# Altium schematic sheet 智能马桶综合检测台V2.0.SchDoc
size A1; PageSetup: Record=PageOptions|CenterHorizontal=True|CenterVertical=True|PrintScale=0.52|XCorrection=1.00|YCorrection=1.00|PrintKind=1|BorderSize=5000000|LeftOffset=0|BottomOffset=0|Orientation=2|PaperLength=2970|PaperWidth=2100|Scale=100|PaperSource=7|PrintQuality=600|MediaType=1|DitherType=10|PaperKind=A4|PrintScaleMode=1
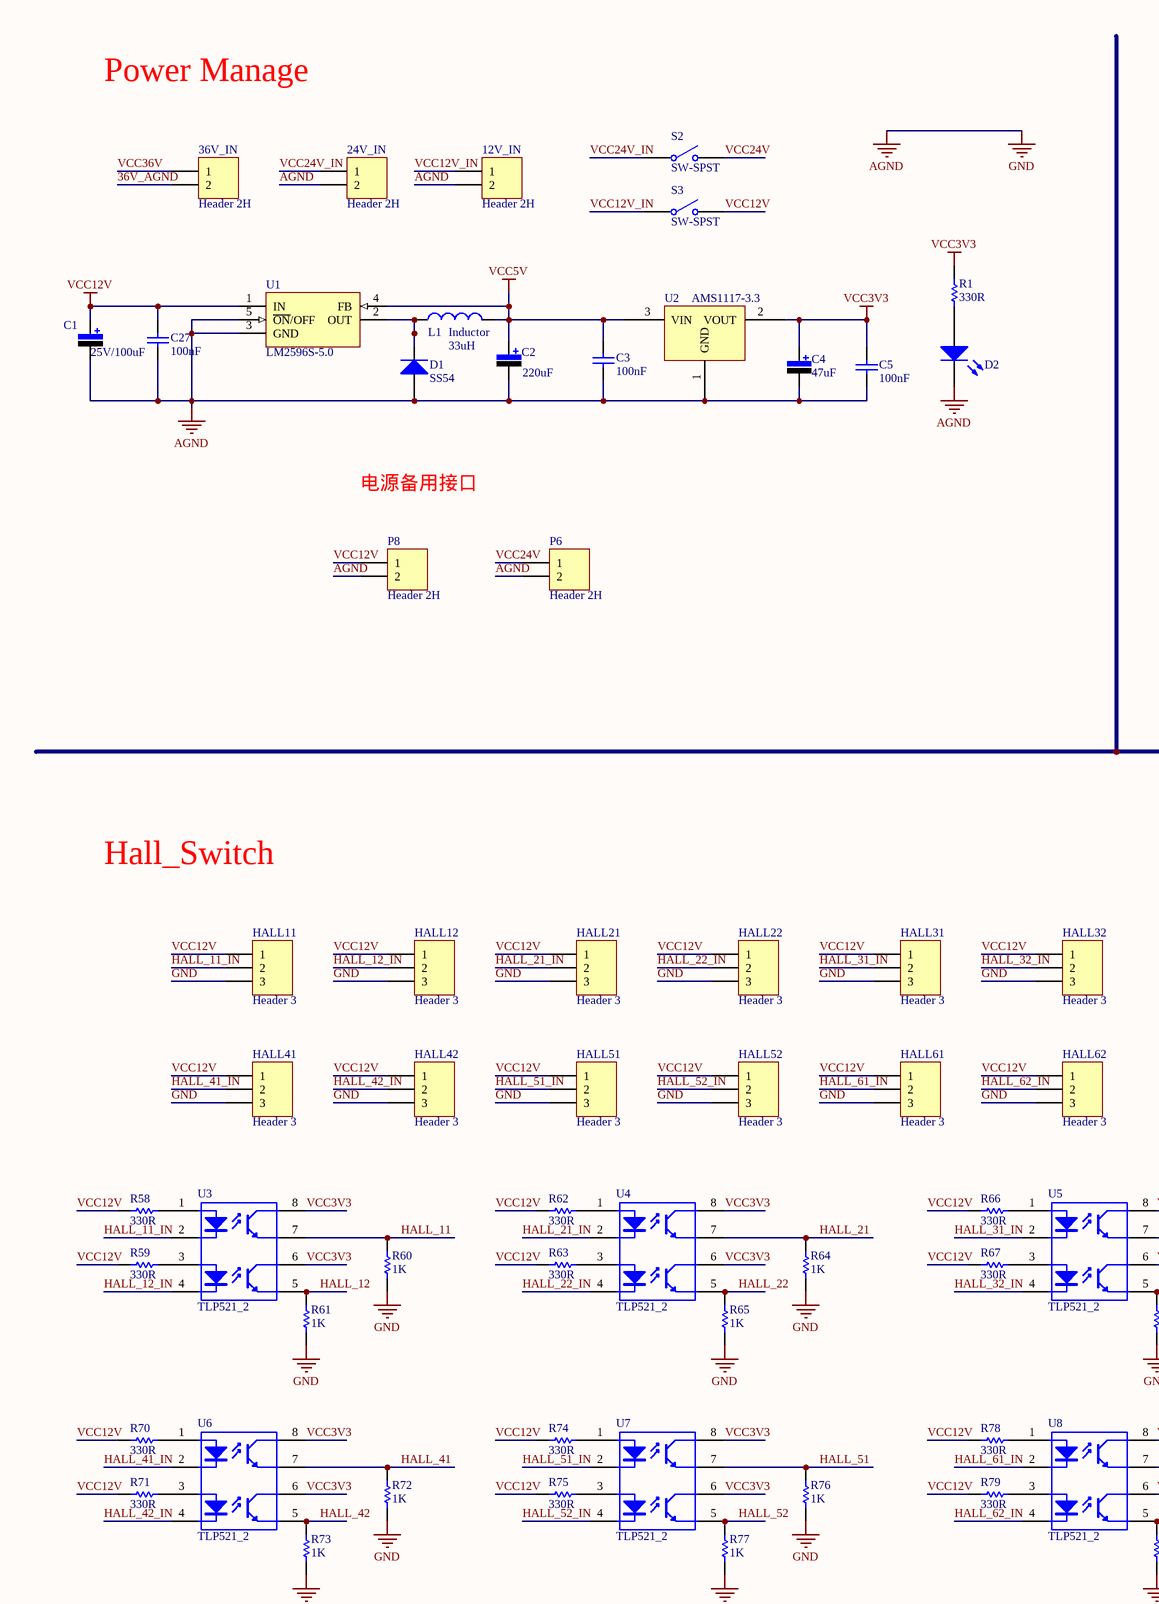
[diagram p0: 智能马桶综合检测台V2.0.SchDoc, top left]
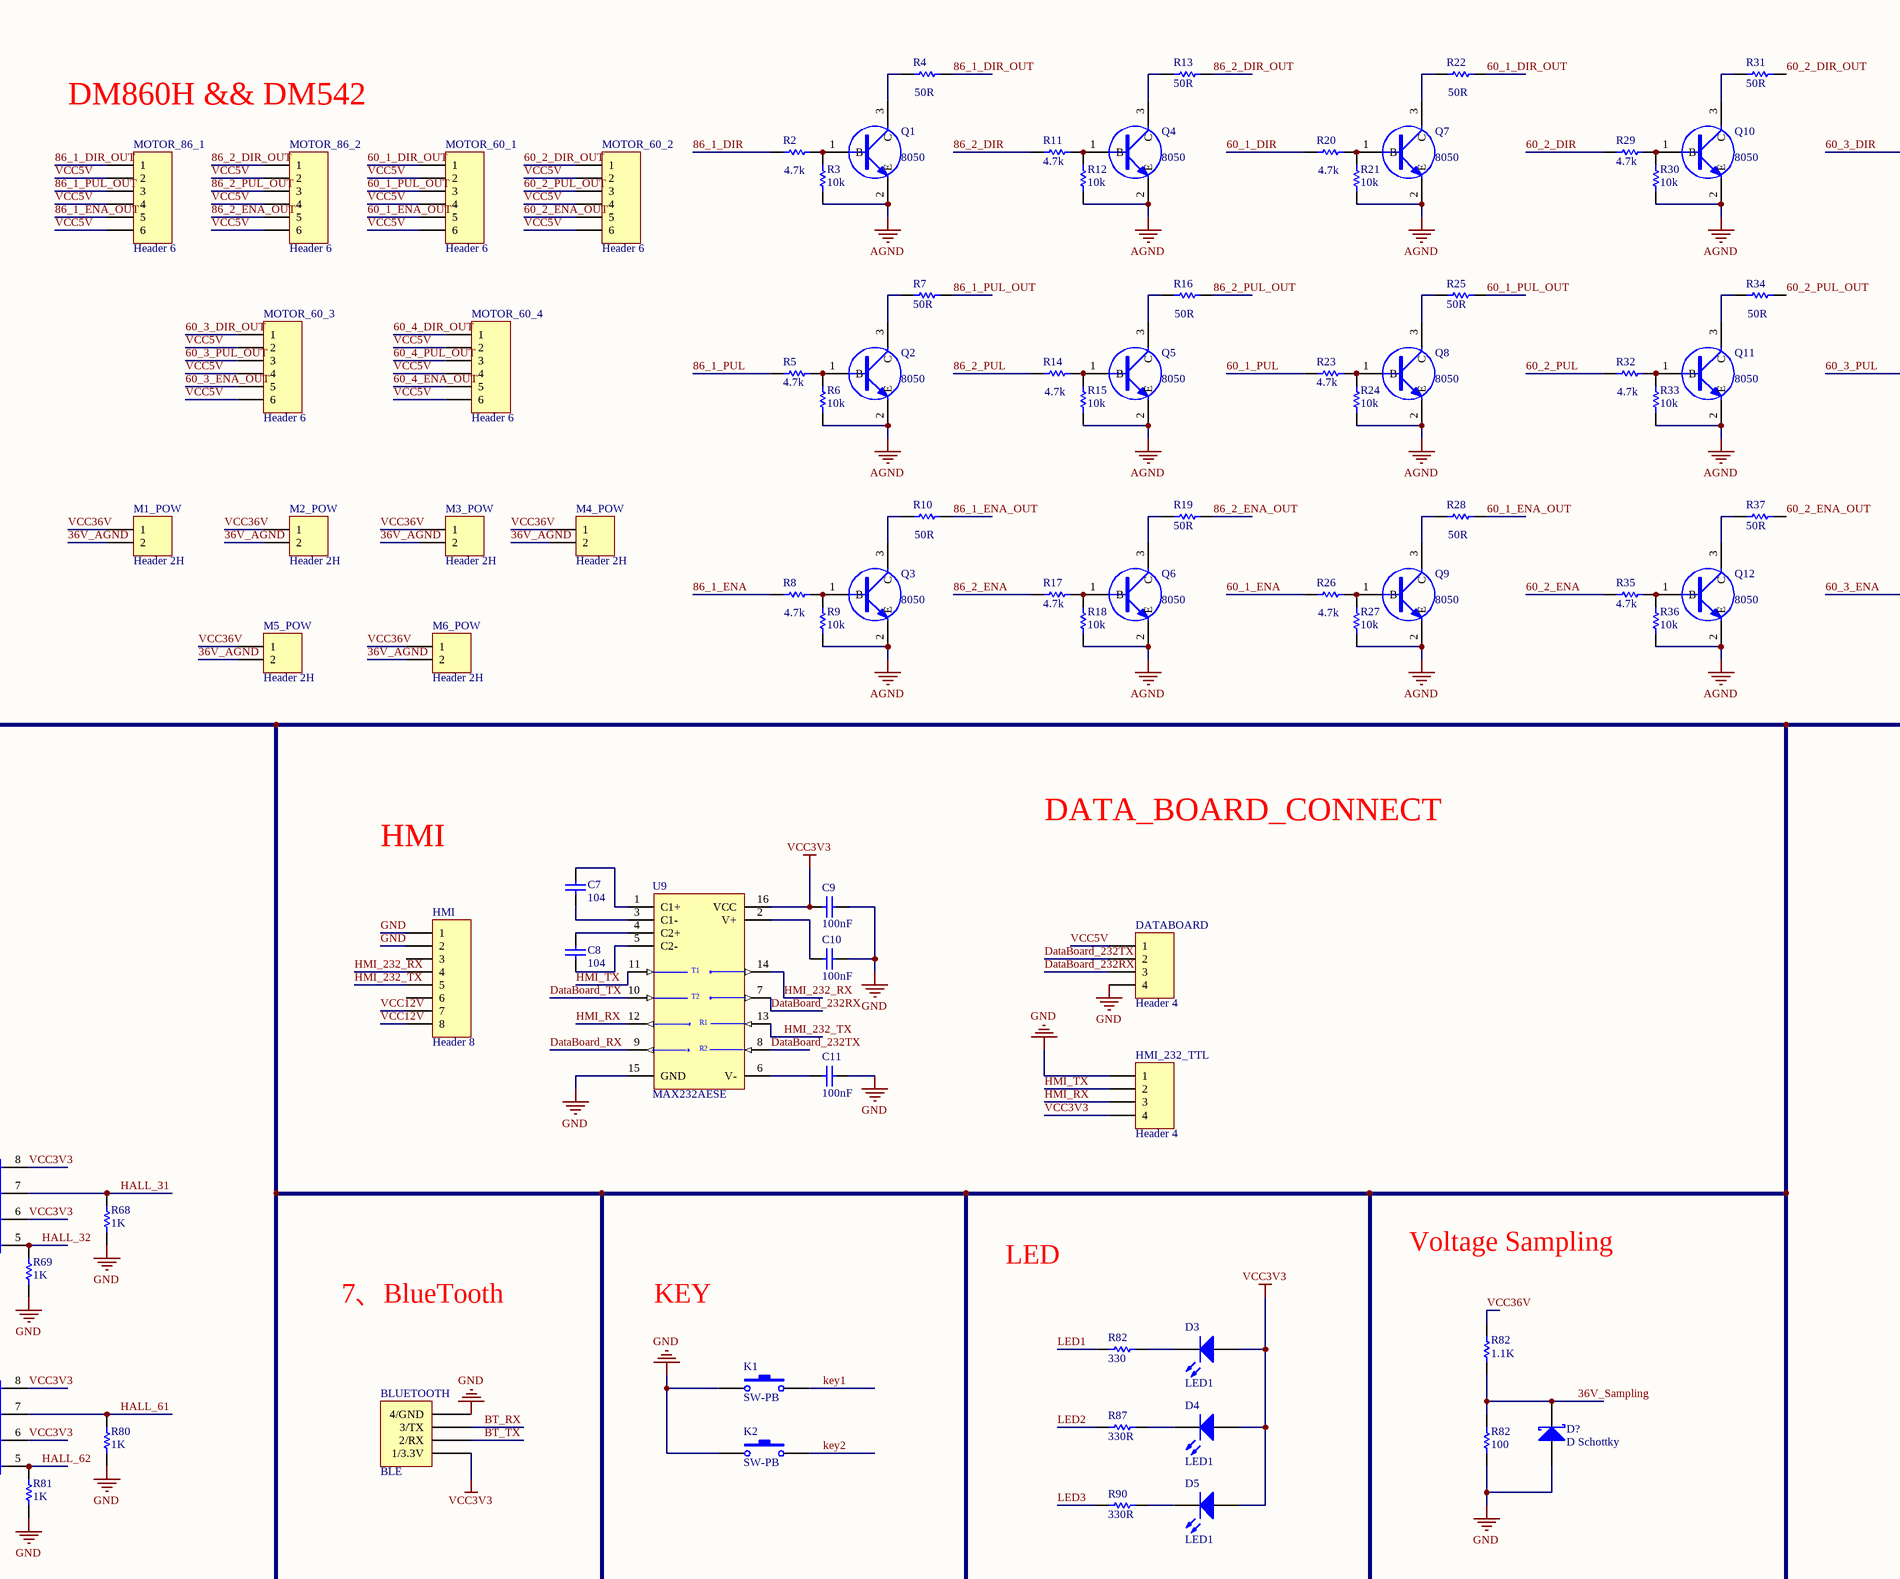
[diagram p1: 智能马桶综合检测台V2.0.SchDoc, top middle]
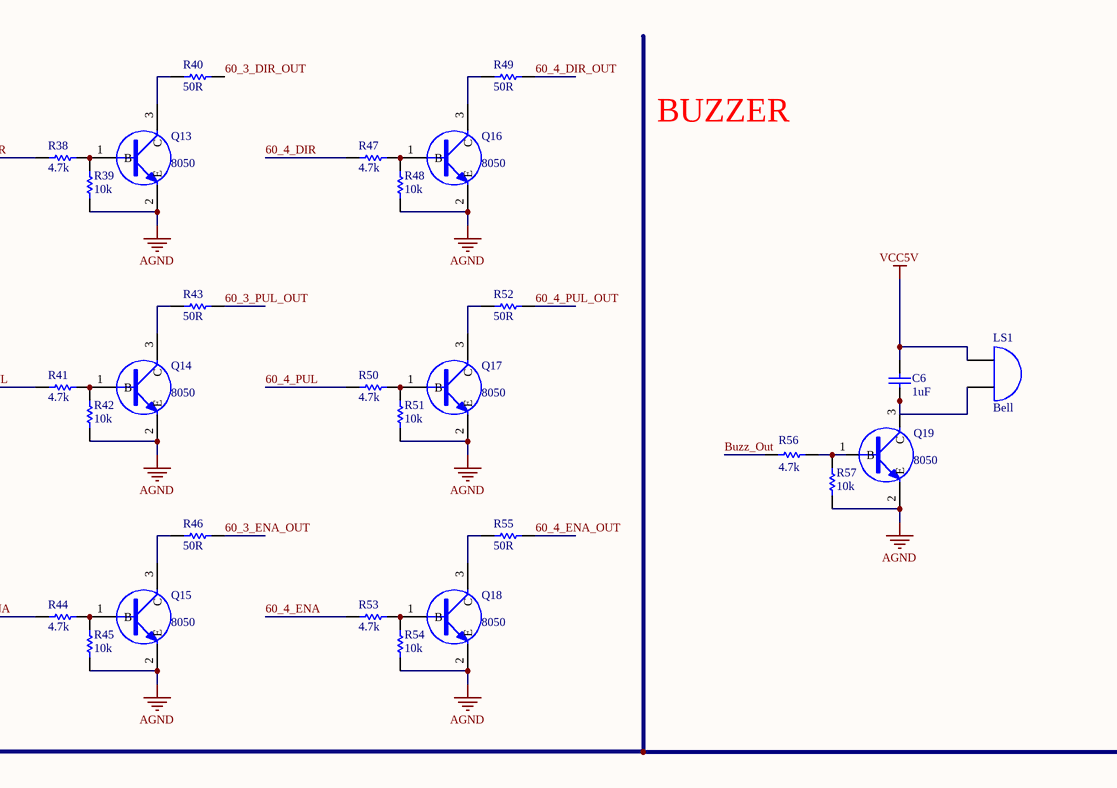
[diagram p2: 智能马桶综合检测台V2.0.SchDoc, top right]
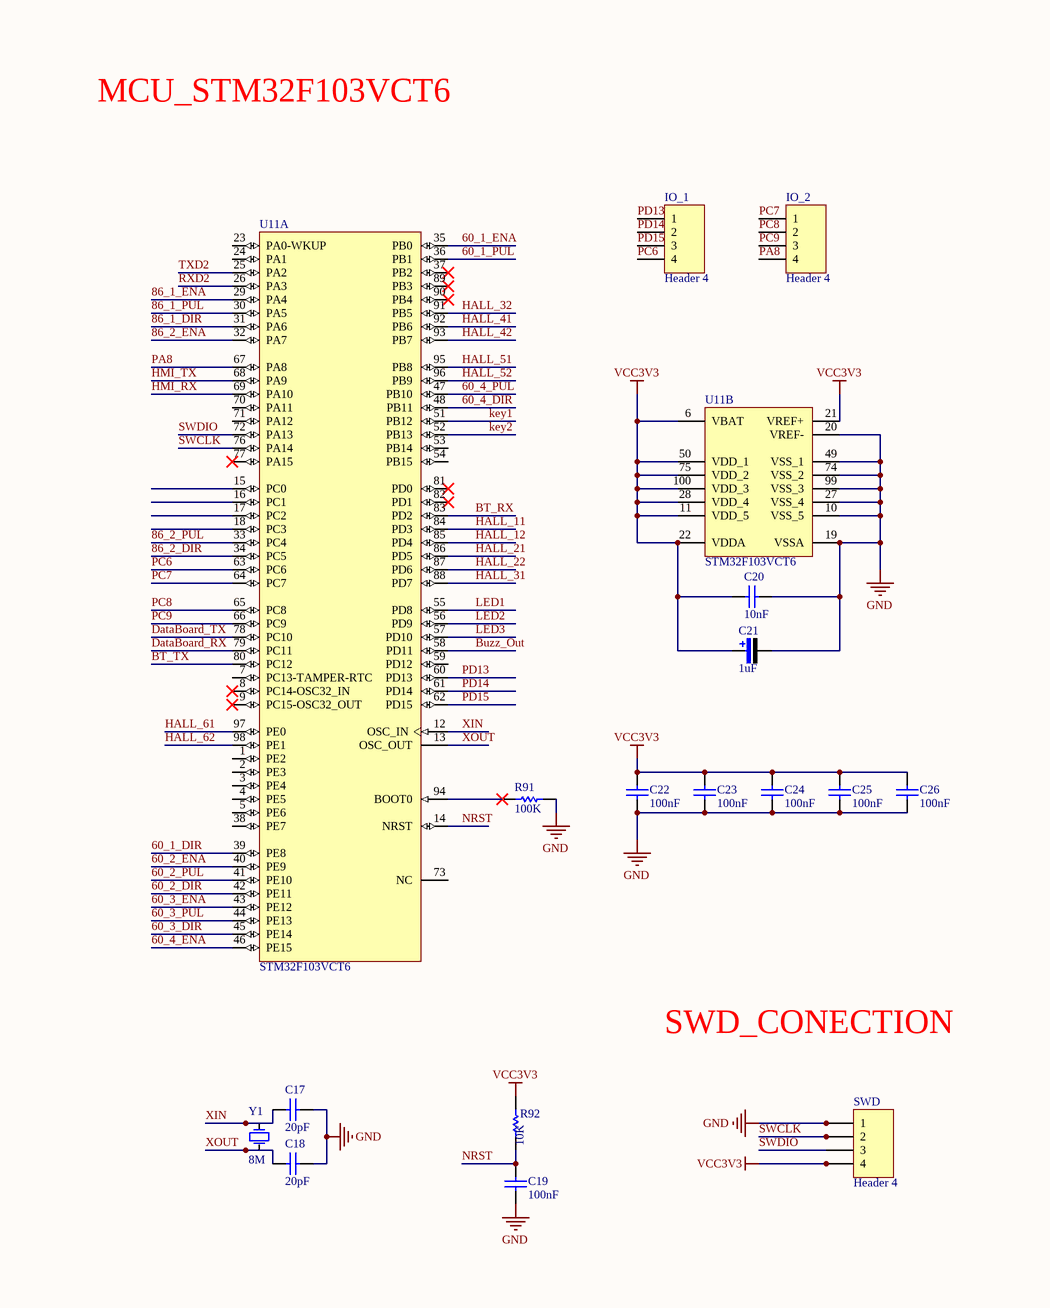
[diagram p3: 智能马桶综合检测台V2.0.SchDoc, bottom left]

## Parts
(Parts that share a designator on the sheet are numbered #1, #2 ... from top to bottom, then left to right.)
12V_IN  Header 2H  [4.2mm接插件2P]
24V_IN  Header 2H  [4.2mm接插件2P]
36V_IN  Header 2H  [大端子]
BLUETOOTH  BLE  [BLE4.0]
C1  value 25V/100uF  [CC6.56.5]  (hidden comment: Cap Pol)
C2  value 220uF  [CC6.56.5]  (hidden comment: Cap Pol)
C3  value 100nF  [CAP-0805]  (hidden comment: Cap)
C4  value 47uF  [1210]  (hidden comment: Cap Pol)
C5  value 100nF  [CAP-0805]  (hidden comment: Cap)
C6  value 1uF  [1206]  (hidden comment: Cap)
C7  value 104  [CAP-0805]  (hidden comment: Cap)
C8  value 104  [CAP-0805]  (hidden comment: Cap)
C9  value 100nF  [CAP-0805]  (hidden comment: Cap)
C10  value 100nF  [CAP-0805]  (hidden comment: Cap)
C11  value 100nF  [CAP-0805]  (hidden comment: Cap)
C17  value 20pF  [CAP-0805]  (hidden comment: Cap)
C18  value 20pF  [CAP-0805]  (hidden comment: Cap)
C19  value 100nF  [CAP-0805]  (hidden comment: Cap)
C20  value 10nF  [CAP-0805]  (hidden comment: Cap)
C21  value 1uF  [1206]  (hidden comment: Cap Pol)
C22  value 100nF  [CAP-0805]  (hidden comment: Cap)
C23  value 100nF  [CAP-0805]  (hidden comment: Cap)
C24  value 100nF  [CAP-0805]  (hidden comment: Cap)
C25  value 100nF  [CAP-0805]  (hidden comment: Cap)
C26  value 100nF  [CAP-0805]  (hidden comment: Cap)
C27  value 100nF  [CAP-0805]  (hidden comment: Cap)
D1  Type: SS54  [SMA]  (hidden comment: Diode)
D2  LED0  [LED_0805]  (value not drawn)
D3  LED1  [LED]
D4  LED1  [LED]
D5  LED1  [LED]
D?  D Schottky  [SMB]
DATABOARD  Header 4  [XH-254-4P]
HALL11  Header 3  [XH-254-3P-H]
HALL12  Header 3  [XH-254-3P-H]
HALL21  Header 3  [XH-254-3P-H]
HALL22  Header 3  [XH-254-3P-H]
HALL31  Header 3  [XH-254-3P-H]
HALL32  Header 3  [XH-254-3P-H]
HALL41  Header 3  [XH-254-3P-H]
HALL42  Header 3  [XH-254-3P-H]
HALL51  Header 3  [XH-254-3P-H]
HALL52  Header 3  [XH-254-3P-H]
HALL61  Header 3  [XH-254-3P-H]
HALL62  Header 3  [XH-254-3P-H]
HMI  Header 8  [XH-2.54-8P-H]
HMI_232_TTL  Header 4  [HDR1X4]
IO_1  Header 4  [HDR1X4]
IO_2  Header 4  [HDR1X4]
K1  SW-PB  [KEY_M]
K2  SW-PB  [KEY_M]
L1  Inductor  value 33uH  [功率电感7*7]
LS1  Bell  [有源蜂鸣器5V]
M1_POW  Header 2H  [大端子]
M2_POW  Header 2H  [大端子]
M3_POW  Header 2H  [大端子]
M4_POW  Header 2H  [大端子]
M5_POW  Header 2H  [大端子]
M6_POW  Header 2H  [大端子]
MOTOR_60_1  Header 6  [XH-2.54-6P-H]
MOTOR_60_2  Header 6  [XH-2.54-6P-H]
MOTOR_60_3  Header 6  [XH-2.54-6P-H]
MOTOR_60_4  Header 6  [XH-2.54-6P-H]
MOTOR_86_1  Header 6  [XH-2.54-6P-H]
MOTOR_86_2  Header 6  [XH-2.54-6P-H]
P6  Header 2H  [4.2mm接插件2P]
P8  Header 2H  [4.2mm接插件2P]
Q1  8050  [SOT-23_3C]
Q2  8050  [SOT-23_3C]
Q3  8050  [SOT-23_3C]
Q4  8050  [SOT-23_3C]
Q5  8050  [SOT-23_3C]
Q6  8050  [SOT-23_3C]
Q7  8050  [SOT-23_3C]
Q8  8050  [SOT-23_3C]
Q9  8050  [SOT-23_3C]
Q10  8050  [SOT-23_3C]
Q11  8050  [SOT-23_3C]
Q12  8050  [SOT-23_3C]
Q13  8050  [SOT-23_3C]
Q14  8050  [SOT-23_3C]
Q15  8050  [SOT-23_3C]
Q16  8050  [SOT-23_3C]
Q17  8050  [SOT-23_3C]
Q18  8050  [SOT-23_3C]
Q19  8050  [SOT-23_3C]
R1  Res  [0805]  (value not drawn)
R2  Res  [0805]  (value not drawn)
R3  Res  [0805]  (value not drawn)
R4  Res  [0805]  (value not drawn)
R5  Res  [0805]  (value not drawn)
R6  Res  [0805]  (value not drawn)
R7  Res  [0805]  (value not drawn)
R8  Res  [0805]  (value not drawn)
R9  Res  [0805]  (value not drawn)
R10  Res  [0805]  (value not drawn)
R11  Res  [0805]  (value not drawn)
R12  Res  [0805]  (value not drawn)
R13  Res  [0805]  (value not drawn)
R14  Res  [0805]  (value not drawn)
R15  Res  [0805]  (value not drawn)
R16  Res  [0805]  (value not drawn)
R17  Res  [0805]  (value not drawn)
R18  Res  [0805]  (value not drawn)
R19  Res  [0805]  (value not drawn)
R20  Res  [0805]  (value not drawn)
R21  Res  [0805]  (value not drawn)
R22  Res  [0805]  (value not drawn)
R23  Res  [0805]  (value not drawn)
R24  Res  [0805]  (value not drawn)
R25  Res  [0805]  (value not drawn)
R26  Res  [0805]  (value not drawn)
R27  Res  [0805]  (value not drawn)
R28  Res  [0805]  (value not drawn)
R29  Res  [0805]  (value not drawn)
R30  Res  [0805]  (value not drawn)
R31  Res  [0805]  (value not drawn)
R32  Res  [0805]  (value not drawn)
R33  Res  [0805]  (value not drawn)
R34  Res  [0805]  (value not drawn)
R35  Res  [0805]  (value not drawn)
R36  Res  [0805]  (value not drawn)
R37  Res  [0805]  (value not drawn)
R38  Res  [0805]  (value not drawn)
R39  Res  [0805]  (value not drawn)
R40  Res  [0805]  (value not drawn)
R41  Res  [0805]  (value not drawn)
R42  Res  [0805]  (value not drawn)
R43  Res  [0805]  (value not drawn)
R44  Res  [0805]  (value not drawn)
R45  Res  [0805]  (value not drawn)
R46  Res  [0805]  (value not drawn)
R47  Res  [0805]  (value not drawn)
R48  Res  [0805]  (value not drawn)
R49  Res  [0805]  (value not drawn)
R50  Res  [0805]  (value not drawn)
R51  Res  [0805]  (value not drawn)
R52  Res  [0805]  (value not drawn)
R53  Res  [0805]  (value not drawn)
R54  Res  [0805]  (value not drawn)
R55  Res  [0805]  (value not drawn)
R56  Res  [0805]  (value not drawn)
R57  Res  [0805]  (value not drawn)
R58  Res  [0805]  (value not drawn)
R59  Res  [0805]  (value not drawn)
R60  Res  [0805]  (value not drawn)
R61  Res  [0805]  (value not drawn)
R62  Res  [0805]  (value not drawn)
R63  Res  [0805]  (value not drawn)
R64  Res  [0805]  (value not drawn)
R65  Res  [0805]  (value not drawn)
R66  Res  [0805]  (value not drawn)
R67  Res  [0805]  (value not drawn)
R68  Res  [0805]  (value not drawn)
R69  Res  [0805]  (value not drawn)
R70  Res  [0805]  (value not drawn)
R71  Res  [0805]  (value not drawn)
R72  Res  [0805]  (value not drawn)
R73  Res  [0805]  (value not drawn)
R74  Res  [0805]  (value not drawn)
R75  Res  [0805]  (value not drawn)
R76  Res  [0805]  (value not drawn)
R77  Res  [0805]  (value not drawn)
R78  Res  [0805]  (value not drawn)
R79  Res  [0805]  (value not drawn)
R80  Res  [0805]  (value not drawn)
R81  Res  [0805]  (value not drawn)
R82#1  Res  [0805]  (value not drawn)
R82#2  Res  [0805]  (value not drawn)
R82#3  Res  [0805]  (value not drawn)
R87  Res  [0805]  (value not drawn)
R90  Res  [0805]  (value not drawn)
R91  Res  [0805]  (value not drawn)
R92  Res  [0805]  (value not drawn)
S2  SW-SPST  [HDR1X2]
S3  SW-SPST  [HDR1X2]
SWD  Header 4  [HDR1X4]
U1  LM2596S-5.0  [TO-263-5L(D2PAK)]
U2  AMS1117-3.3  [SOT223]
U3  TLP521_2  [TLP521-2]
U4  TLP521_2  [TLP521-2]
U5  TLP521_2  [TLP521-2]
U6  TLP521_2  [TLP521-2]
U7  TLP521_2  [TLP521-2]
U8  TLP521_2  [TLP521-2]
U9  MAX232AESE  [L16_L]
U11  STM32F103VCT6  [STM-LQFP100_N]  (parts A,B of 2)
Y1  value 8M  [X-HC49U]  (hidden comment: XTAL)

## Nets
AGND: 12V_IN.2 24V_IN.2 BLUETOOTH.4(4/GND) C1.2 C2.2 C3.1 C4.2 C5.1 C9.1 C10.1 C11.1 C17.1 C18.1 C19.2 C20.1 C21.2 C22.2 C23.2 C24.2 C25.2 C26.2 C27.1 D1.1(A) D2.2(K) D?.1(A) DATABOARD.4 HALL11.3 HALL12.3 HALL21.3 HALL22.3 HALL31.3 HALL32.3 HALL41.3 HALL42.3 HALL51.3 HALL52.3 HALL61.3 HALL62.3 HMI.1 HMI.2 HMI_232_TTL.1 K1.1 K2.1 P6.2 P8.2 Q1.2(E) Q2.2(E) Q3.2(E) Q4.2(E) Q5.2(E) Q6.2(E) Q7.2(E) Q8.2(E) Q9.2(E) Q10.2(E) Q11.2(E) Q12.2(E) Q13.2(E) Q14.2(E) Q15.2(E) Q16.2(E) Q17.2(E) Q18.2(E) Q19.2(E) R3.2 R6.1 R9.2 R12.1 R15.2 R18.1 R21.2 R24.1 R27.2 R30.1 R33.2 R36.1 R39.1 R42.2 R45.2 R48.1 R51.2 R54.2 R57.2 R60.1 R61.1 R64.1 R65.1 R68.1 R69.1 R72.1 R73.1 R76.1 R77.1 R80.1 R81.1 R82#3.1 R91.2 SWD.1 U1.3(GND) U1.5(~{ON}/OFF) U2.1(GND) U9.15(GND) U11.10(VSS_5) U11.19(VSSA) U11.20(VREF-) U11.27(VSS_4) U11.49(VSS_1) U11.74(VSS_2) U11.99(VSS_3)  [also labelled GND]
VCC3V3: BLUETOOTH.1(1/3.3V) C4.1 C5.2 C9.2 C20.2 C21.1 C22.1 C23.1 C24.1 C25.1 C26.1 D3.1(A) D4.1(A) D5.1(A) HMI_232_TTL.4 R1.2 R92.2 SWD.4 U2.2(VOUT) U3.6(C) U3.8(C) U4.6(C) U4.8(C) U5.6(C) U5.8(C) U6.6(C) U6.8(C) U7.6(C) U7.8(C) U8.6(C) U8.8(C) U9.16(VCC) U11.6(VBAT) U11.11(VDD_5) U11.21(VREF+) U11.22(VDDA) U11.28(VDD_4) U11.50(VDD_1) U11.75(VDD_2) U11.100(VDD_3)
VCC5V: C2.1 C3.2 C6.2 DATABOARD.1 L1.2 LS1.1(A) MOTOR_60_1.2 MOTOR_60_1.4 MOTOR_60_1.6 MOTOR_60_2.2 MOTOR_60_2.4 MOTOR_60_2.6 MOTOR_60_3.2 MOTOR_60_3.4 MOTOR_60_3.6 MOTOR_60_4.2 MOTOR_60_4.4 MOTOR_60_4.6 MOTOR_86_1.2 MOTOR_86_1.4 MOTOR_86_1.6 MOTOR_86_2.2 MOTOR_86_2.4 MOTOR_86_2.6 U1.4(FB) U2.3(VIN)
VCC12V: C1.1 C27.2 HALL11.1 HALL12.1 HALL21.1 HALL22.1 HALL31.1 HALL32.1 HALL41.1 HALL42.1 HALL51.1 HALL52.1 HALL61.1 HALL62.1 HMI.7 HMI.8 P8.1 R58.1 R59.1 R62.1 R63.1 R66.1 R67.1 R70.1 R71.1 R74.1 R75.1 R78.1 R79.1 S3.2(NO) U1.1(IN)
36V_AGND: 36V_IN.2 M1_POW.2 M2_POW.2 M3_POW.2 M4_POW.2 M5_POW.2 M6_POW.2
36V_Sampling: D?.2(K) R82#2.1 R82#3.2
60_1_DIR: R20.1 U11.39(PE8)
60_1_DIR_OUT: MOTOR_60_1.1 R22.2
60_1_ENA: R26.1 U11.35(PB0)
60_1_ENA_OUT: MOTOR_60_1.5 R28.2
60_1_PUL: R23.1 U11.36(PB1)
60_1_PUL_OUT: MOTOR_60_1.3 R25.2
60_2_DIR: R29.1 U11.42(PE11)
60_2_DIR_OUT: MOTOR_60_2.1 R31.2
60_2_ENA: R35.1 U11.40(PE9)
60_2_ENA_OUT: MOTOR_60_2.5 R37.2
60_2_PUL: R32.1 U11.41(PE10)
60_2_PUL_OUT: MOTOR_60_2.3 R34.2
60_3_DIR: R38.2 U11.45(PE14)
60_3_DIR_OUT: MOTOR_60_3.1 R40.2
60_3_ENA: R44.2 U11.43(PE12)
60_3_ENA_OUT: MOTOR_60_3.5 R46.2
60_3_PUL: R41.2 U11.44(PE13)
60_3_PUL_OUT: MOTOR_60_3.3 R43.2
60_4_DIR: R47.2 U11.48(PB11)
60_4_DIR_OUT: MOTOR_60_4.1 R49.2
60_4_ENA: R53.2 U11.46(PE15)
60_4_ENA_OUT: MOTOR_60_4.5 R55.2
60_4_PUL: R50.2 U11.47(PB10)
60_4_PUL_OUT: MOTOR_60_4.3 R52.2
86_1_DIR: R2.1 U11.31(PA6)
86_1_DIR_OUT: MOTOR_86_1.1 R4.2
86_1_ENA: R8.1 U11.29(PA4)
86_1_ENA_OUT: MOTOR_86_1.5 R10.2
86_1_PUL: R5.1 U11.30(PA5)
86_1_PUL_OUT: MOTOR_86_1.3 R7.2
86_2_DIR: R11.1 U11.34(PC5)
86_2_DIR_OUT: MOTOR_86_2.1 R13.2
86_2_ENA: R17.1 U11.32(PA7)
86_2_ENA_OUT: MOTOR_86_2.5 R19.2
86_2_PUL: R14.1 U11.33(PC4)
86_2_PUL_OUT: MOTOR_86_2.3 R16.2
BT_RX: BLUETOOTH.3(3/TX) U11.83(PD2)
BT_TX: BLUETOOTH.2(2/RX) U11.80(PC12)
Buzz_Out: R56.1 U11.58(PD11)
DataBoard_232RX: DATABOARD.3 U9.7(T2OUT)
DataBoard_232TX: DATABOARD.2 U9.8(R2IN)
DataBoard_RX: U9.9(R2OUT) U11.79(PC11)
DataBoard_TX: U9.10(T2IN) U11.78(PC10)
HALL_11: R60.2 U3.7(E) U11.84(PD3)
HALL_11_IN: HALL11.2 U3.2(K)
HALL_12: R61.2 U3.5(E) U11.85(PD4)
HALL_12_IN: HALL12.2 U3.4(K)
HALL_21: R64.2 U4.7(E) U11.86(PD5)
HALL_21_IN: HALL21.2 U4.2(K)
HALL_22: R65.2 U4.5(E) U11.87(PD6)
HALL_22_IN: HALL22.2 U4.4(K)
HALL_31: R68.2 U5.7(E) U11.88(PD7)
HALL_31_IN: HALL31.2 U5.2(K)
HALL_32: R69.2 U5.5(E) U11.91(PB5)
HALL_32_IN: HALL32.2 U5.4(K)
HALL_41: R72.2 U6.7(E) U11.92(PB6)
HALL_41_IN: HALL41.2 U6.2(K)
HALL_42: R73.2 U6.5(E) U11.93(PB7)
HALL_42_IN: HALL42.2 U6.4(K)
HALL_51: R76.2 U7.7(E) U11.95(PB8)
HALL_51_IN: HALL51.2 U7.2(K)
HALL_52: R77.2 U7.5(E) U11.96(PB9)
HALL_52_IN: HALL52.2 U7.4(K)
HALL_61: R80.2 U8.7(E) U11.97(PE0)
HALL_61_IN: HALL61.2 U8.2(K)
HALL_62: R81.2 U8.5(E) U11.98(PE1)
HALL_62_IN: HALL62.2 U8.4(K)
HMI_232_RX: HMI.4 U9.14(T1OUT)
HMI_232_TX: HMI.5 U9.13(R1IN)
HMI_RX: HMI_232_TTL.3 U9.12(R1OUT) U11.69(PA10)
HMI_TX: HMI_232_TTL.2 U9.11(T1IN) U11.68(PA9)
key1: K1.2 U11.51(PB12)
key2: K2.2 U11.52(PB13)
LED1: R82#1.1 U11.55(PD8)
LED2: R87.1 U11.56(PD9)
LED3: R90.1 U11.57(PD10)
NRST: C19.1 R92.1 U11.14(NRST)
PA8: IO_2.4 U11.67(PA8)
PC6: IO_1.4 U11.63(PC6)
PC7: IO_2.1 U11.64(PC7)
PC8: IO_2.2 U11.65(PC8)
PC9: IO_2.3 U11.66(PC9)
PD13: IO_1.1 U11.60(PD13)
PD14: IO_1.2 U11.61(PD14)
PD15: IO_1.3 U11.62(PD15)
RXD2: U11.26(PA3)
SWCLK: SWD.2 U11.76(PA14)
SWDIO: SWD.3 U11.72(PA13)
TXD2: U11.25(PA2)
VCC12V_IN: 12V_IN.1 S3.1(COMMON)
VCC24V: P6.1 S2.2(NO)
VCC24V_IN: 24V_IN.1 S2.1(COMMON)
VCC36V: 36V_IN.1 M1_POW.1 M2_POW.1 M3_POW.1 M4_POW.1 M5_POW.1 M6_POW.1 R82#2.2
XIN: C17.2 U11.12(OSC_IN) Y1.1(OSC1)
XOUT: C18.2 U11.13(OSC_OUT) Y1.2(OSC2)
NetC6_1: C6.1 LS1.2(B) Q19.3(C)
NetC7_1: C7.1 U9.1(C1+)
NetC7_2: C7.2 U9.3(C1-)
NetC8_1: C8.1 U9.4(C2+)
NetC8_2: C8.2 U9.5(C2-)
NetC10_2: C10.2 U9.2(V+)
NetC11_2: C11.2 U9.6(V-)
NetD1_2: D1.2(K) L1.1 U1.2(OUT)
NetD2_1: D2.1(A) R1.1
NetD3_2: D3.2(K) R82#1.2
NetD4_2: D4.2(K) R87.2
NetD5_2: D5.2(K) R90.2
NetQ1_1: Q1.1(B) R2.2 R3.1
NetQ1_3: Q1.3(C) R4.1
NetQ2_1: Q2.1(B) R5.2 R6.2
NetQ2_3: Q2.3(C) R7.1
NetQ3_1: Q3.1(B) R8.2 R9.1
NetQ3_3: Q3.3(C) R10.1
NetQ4_1: Q4.1(B) R11.2 R12.2
NetQ4_3: Q4.3(C) R13.1
NetQ5_1: Q5.1(B) R14.2 R15.1
NetQ5_3: Q5.3(C) R16.1
NetQ6_1: Q6.1(B) R17.2 R18.2
NetQ6_3: Q6.3(C) R19.1
NetQ7_1: Q7.1(B) R20.2 R21.1
NetQ7_3: Q7.3(C) R22.1
NetQ8_1: Q8.1(B) R23.2 R24.2
NetQ8_3: Q8.3(C) R25.1
NetQ9_1: Q9.1(B) R26.2 R27.1
NetQ9_3: Q9.3(C) R28.1
NetQ10_1: Q10.1(B) R29.2 R30.2
NetQ10_3: Q10.3(C) R31.1
NetQ11_1: Q11.1(B) R32.2 R33.1
NetQ11_3: Q11.3(C) R34.1
NetQ12_1: Q12.1(B) R35.2 R36.2
NetQ12_3: Q12.3(C) R37.1
NetQ13_1: Q13.1(B) R38.1 R39.2
NetQ13_3: Q13.3(C) R40.1
NetQ14_1: Q14.1(B) R41.1 R42.1
NetQ14_3: Q14.3(C) R43.1
NetQ15_1: Q15.1(B) R44.1 R45.1
NetQ15_3: Q15.3(C) R46.1
NetQ16_1: Q16.1(B) R47.1 R48.2
NetQ16_3: Q16.3(C) R49.1
NetQ17_1: Q17.1(B) R50.1 R51.1
NetQ17_3: Q17.3(C) R52.1
NetQ18_1: Q18.1(B) R53.1 R54.1
NetQ18_3: Q18.3(C) R55.1
NetQ19_1: Q19.1(B) R56.2 R57.1
NetR58_2: R58.2 U3.1(A)
NetR59_2: R59.2 U3.3(A)
NetR62_2: R62.2 U4.1(A)
NetR63_2: R63.2 U4.3(A)
NetR66_2: R66.2 U5.1(A)
NetR67_2: R67.2 U5.3(A)
NetR70_2: R70.2 U6.1(A)
NetR71_2: R71.2 U6.3(A)
NetR74_2: R74.2 U7.1(A)
NetR75_2: R75.2 U7.3(A)
NetR78_2: R78.2 U8.1(A)
NetR79_2: R79.2 U8.3(A)
NetR91_1: R91.1 U11.94(BOOT0)

Not connected (* = marked no-connect by the designer): HMI 3 6; U11 1(PE2) 2(PE3) 3(PE4) 4(PE5) 5(PE6) 7(PC13-TAMPER-RTC) 8(PC14-OSC32_IN)* 9(PC15-OSC32_OUT)* 15(PC0) 16(PC1) 17(PC2) 18(PC3) 23(PA0-WKUP) 24(PA1) 37(PB2)* 38(PE7) 53(PB14) 54(PB15) 59(PD12) 70(PA11) 71(PA12) 73(NC) 77(PA15)* 81(PD0)* 82(PD1)* 89(PB3)* 90(PB4)*

## Notes on the sheet
- Power Manage
- DM860H && DM542
- BUZZER
- 电源备用接口
- Hall_Switch
- DATA_BOARD_CONNECT
- HMI
- LED
- Voltage Sampling
- 7、BlueTooth
- KEY
- MCU_STM32F103VCT6
- SWD_CONECTION
- (in symbol MAX232AESE) T1; T2; R1; R2
- (in symbol Res1) 330R; 4.7k; 10k; 50R; 1K; 330; 10K; 100K; 1.1K; 100

## Library data of the parts
12V_IN 24V_IN 36V_IN M1_POW M2_POW M3_POW M4_POW M5_POW M6_POW P6 P8 = Header 2H: Header, 2-Pin, Right Angle; LatestRevisionDate: 17-Jul-2002; LatestRevisionNote: Re-released for DXP Platform.; Publisher: Altium Limited
BLUETOOTH = BLE4.0
C1 C2 C4 C21 = Cap Pol: 极性电解电容; Vol: 16V; Published: 8-Jun-2000; LatestRevisionDate: 17-Jul-2002; LatestRevisionNote: Re-released for DXP Platform.; PackageReference: RB7.6-15; Publisher: Altium Limited
C3 C5-C11 C17-C20 C22-C27 = Cap: 无极性电容; Published: 8-Jun-2000; LatestRevisionDate: 17-Jul-2002; LatestRevisionNote: Re-released for DXP Platform.; PackageReference: RAD-0.3; Publisher: Altium Limited
D1 = Diode: 二极管; Published: 8-Jun-2000; LatestRevisionDate: 17-Jul-2002; LatestRevisionNote: Re-released for DXP Platform.; PackageDocument: Sep-1996; PackageReference: SMC; Publisher: Altium Limited; Code_JEDEC: DO-214-AB
D2 = LED0: 发光二极管; Published: 8-Jun-2000; LatestRevisionDate: 08-Jul-2005; LatestRevisionNote: Mech Layer 1 removed.; PackageReference: LED-0; Publisher: Altium Limited
D3-D5 = LED1: Typical RED GaAs LED; Published: 8-Jun-2000; LatestRevisionDate: 08-Jul-2005; LatestRevisionNote: Mech Layer 1 removed.; PackageReference: LED-1; Publisher: Altium Limited
D? = D Schottky: Schottky Diode; Published: 8-Jun-2000; LatestRevisionDate: 17-Jul-2002; LatestRevisionNote: Re-released for DXP Platform.; PackageReference: SMB; Publisher: Altium Limited; Code_JEDEC: DO-214-AA
DATABOARD HMI_232_TTL IO_1 IO_2 SWD = Header 4: Header, 4-Pin; LatestRevisionDate: 17-Jul-2002; LatestRevisionNote: Re-released for DXP Platform.; Publisher: Altium Limited
HALL11 HALL12 HALL21 HALL22 HALL31 HALL32 HALL41 HALL42 HALL51 HALL52 HALL61 HALL62 = Header 3: Header, 3-Pin; LatestRevisionDate: 17-Jul-2002; LatestRevisionNote: Re-released for DXP Platform.; Publisher: Altium Limited
HMI = Header 8: Header, 8-Pin; LatestRevisionDate: 17-Jul-2002; LatestRevisionNote: Re-released for DXP Platform.; Publisher: Altium Limited
K1 K2 = SW-PB: Switch; Published: 24-Mar-1999; LatestRevisionDate: 17-Jul-2002; LatestRevisionNote: Re-released for DXP Platform.; PackageReference: SPST-2; Publisher: Altium Limited
L1 = Inductor: Code_IEC: 1005; Published: 8-Jun-2000; LatestRevisionDate: 17-Jul-2002; LatestRevisionNote: Re-released for DXP Platform.; PackageReference: 0402-A; Publisher: Altium Limited; Code_JEITA: 0402
LS1 = Bell: Electrical Bell; Published: 24-Mar-1999; LatestRevisionDate: 17-Jul-2002; LatestRevisionNote: Re-released for DXP Platform.; PackageReference: PIN2; Publisher: Altium Limited
MOTOR_60_1-MOTOR_60_4 MOTOR_86_1 MOTOR_86_2 = Header 6: Header, 6-Pin; LatestRevisionDate: 17-Jul-2002; LatestRevisionNote: Re-released for DXP Platform.; Publisher: Altium Limited
Q1-Q19 = NPN(1)
R1-R81 R82#1-R82#3 R87 R90-R92 = Res1: 贴片电阻; Published: 8-Jun-2000; LatestRevisionDate: 17-Jul-2002; LatestRevisionNote: Re-released for DXP Platform.; PackageReference: AXIAL-0.4; Publisher: Altium Limited
S2 S3 = SW-SPST: Single-Pole, Single-Throw Switch; Published: 24-Mar-1999; LatestRevisionDate: 17-Jul-2002; LatestRevisionNote: Re-released for DXP Platform.; PackageReference: SPST-2; Publisher: Altium Limited
U1 = LM2596S-5.0: Simple Switcher Power Converter 150 kHz 3A Step Down Voltage Regulator; Note: Tab is connected to GND; Published: 15-Apr-2002; DatasheetVersion: Dec-1997; PackageReference: TS5B; Publisher: Altium Limited; PackageDescription: D2-PAK; 5 Leads; Body 14.4 (inc. leads) x 10.4 mm (LxW max); ComponentLink1Description: Manufacturer Link; ComponentLink1URL: http://www.national.com/; ComponentLink2Description: Datasheet; ComponentLink2URL: http://www.national.com/ds.cgi/LM/LM2596.pdf; ComponentLink3Description: URL Link1; ComponentLink3URL: http://www.national.com/pf/LM/LM2596.html
U2 = AS1117
U9 = MAX232AESE: +5V-Powered, Multichannel RS-232 Driver/Receiver; Published: 16-Jan-2001; LatestRevisionDate: 13-Apr-2006; LatestRevisionNote: IPC-7351 Footprint Added.; DatasheetVersion: Nov-1997; PackageReference: NSO16; Publisher: Altium Limited; PackageDescription: 16-Pin Small Outline Integrated Circuit 1.27 mm Pitch; Code_JEDEC: MS-012-AC; Code_IPC: SOIC127P600-16; ComponentLink1Description: Manufacturer Link; ComponentLink1URL: http://www.maxim-ic.com/; ComponentLink2Description: Datasheet; ComponentLink2URL: http://pdfserv.maxim-ic.com/en/ds/MAX220-MAX249.pdf
U11 = STM32F103VCT6: ARM Cortex-M3 32-bit MCU, 256 KB Flash, 48 KB Internal RAM, 80 I/Os, 100-pin LQFP, -40 to 85 degC, Tray; A/D Converter: 3x12-bit (16 Channel); D/A Converter: 2x12-bit (2 Channel); FLASH Size (Prog) (kB): 256; I/Os (High Current): 80; Internal RAM Size (kB): 48; Operating Frequency(F) (Processor speed) (MHz): 72; Supply Voltage(Vcc) min (V): 2; DatasheetVersion: Rev. 8; PackageVersion: Rev. 1, 06/2013; PackageReference: LQFP100; PackageDescription: 100-Pin Low Profile Quad Flat Package, 14 x 14 mm Body, 0.5 mm Pitch; Supplier 1: Digi-Key; Supplier Part Number 1: 497-9034-ND; Supplier 2: Farnell; Supplier Part Number 2: 1624139; Supplier 3: Newark; Supplier Part Number 3: 57P1255; Supplier 4: Mouser; Supplier Part Number 4: 511-STM32F103VCT6; Core: ARM Cortex-M3; Packing: Tray; Mounting Technology: Surface Mount; PartNumber: STM32F103VCT6; ComponentLink1Description: Manufacturer URL; ComponentLink1URL: http://www.st.com/web/en/home.html; ComponentLink2Description: Datasheet; ComponentLink2URL: http://www.st.com/st-web-ui/static/active/en/resource/technical/document/datasheet/CD00191185.pdf; ComponentLink3Description: Package Specification; ComponentLink3URL: http://www.st.com/st-web-ui/static/active/en/resource/technical/document/data_brief/DM00071938.pdf
Y1 = XTAL: 晶振; Published: 8-Jun-2000; LatestRevisionDate: 17-Jul-2002; LatestRevisionNote: Re-released for DXP Platform.; PackageReference: R38; Publisher: Altium Limited